# EAGLE schematic Atari_Punk_Console (EAGLE 6.4)
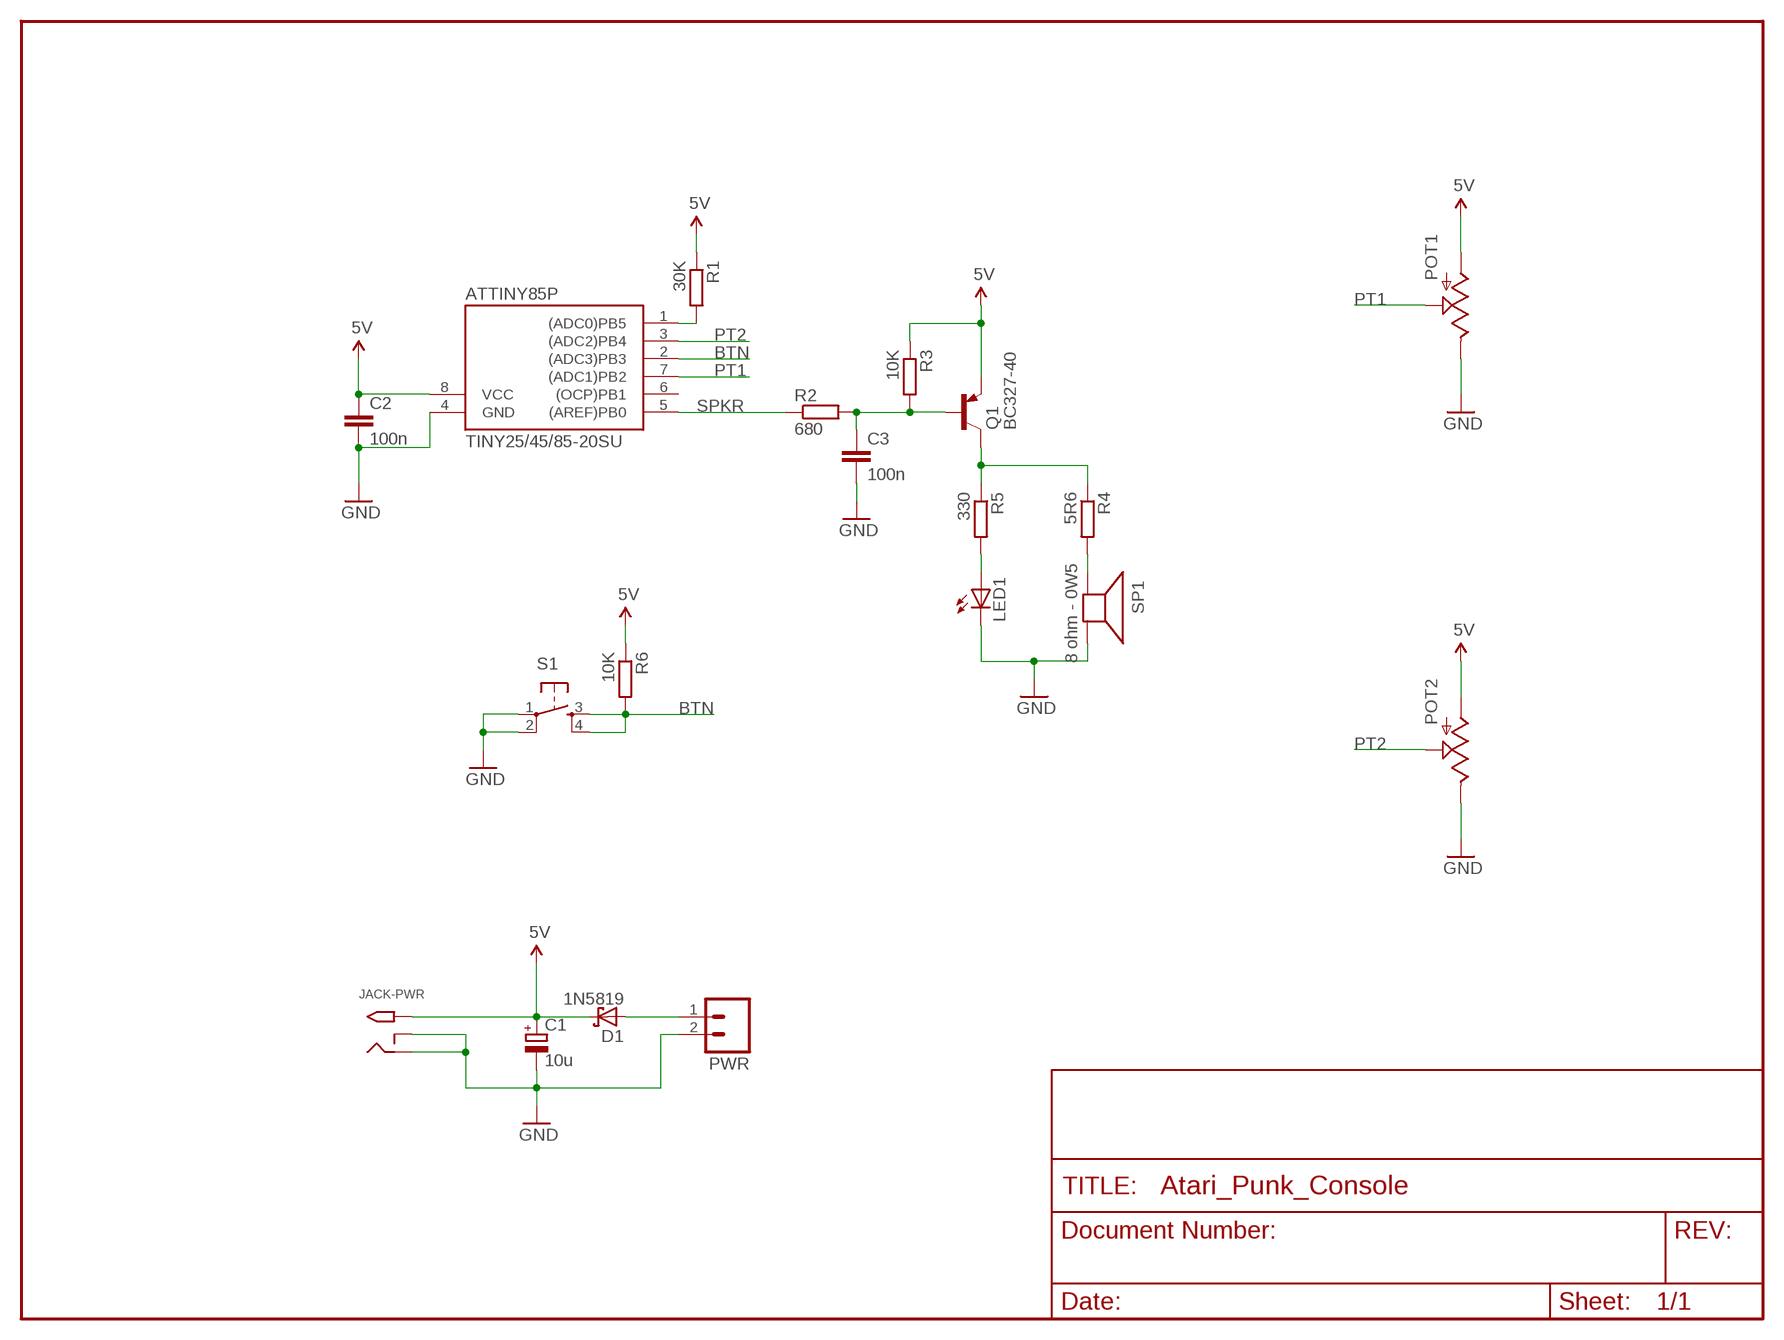
[diagram p0: schematic, sheet 1]

## Parts
ATTINY85P  TINY25/45/85-20SU  [SOIC8]
C1  10u  CPOL-EUE2.5-6  [E2,5-6]
C2  100n  C-EU025-025X050  [C025-025X050]
C3  100n  C-EU025-025X050  [C025-025X050]
D1  1N5819  SCHOTTKY-DIODEDO41-7  [DO41-7]
JACK-PWR  2.1MMJACKTHM  [PJ-102A]
LED1  LED5MM  [LED5MM]
POT1  POT  [ALPS_POT]
POT2  POT  [ALPS_POT]
PWR  M02LOCK  [1X02_LOCK]
Q1  BC327-40  2N2907  [TO92-EBC-OVAL]
R1  30K  R-EU_0207/10  [0207/10]
R2  680  R-EU_0207/10  [0207/10]
R3  10K  R-EU_0207/10  [0207/10]
R4  5R6  R-EU_0207/10  [0207/10]
R5  330  R-EU_0207/10  [0207/10]
R6  10K  R-EU_0207/10  [0207/10]
S1  TAC_SWITCHPTH  [TACTILE-PTH]
SP1  8 ohm - 0W5  SPEAKER/PS12  [PS12]

## Nets
5V: ATTINY85P.8(VCC) C1.+ C2.1 D1.C JACK-PWR.TIP POT1.P$3(A) POT2.P$3(A) Q1.E R1.1 R3.1 R6.1
BTN: ATTINY85P.2((ADC3)PB3) R6.2 S1.3 S1.4
GND: ATTINY85P.4(GND) C1.- C2.2 C3.2 JACK-PWR.RING JACK-PWR.RING_SW LED1.K(C) POT1.P$1(E) POT2.P$1(E) PWR.2 S1.1 S1.2 SP1.P$2(-)
N$1: R4.2 SP1.P$1(+)
N$2: D1.A PWR.1
N$3: Q1.C R4.1 R5.1
N$4: ATTINY85P.1((ADC0)PB5) R1.2
N$5: C3.1 Q1.B R2.2 R3.2
N$8: LED1.A R5.2
PT1: ATTINY85P.7((ADC1)PB2) POT1.P$2(S)
PT2: ATTINY85P.3((ADC2)PB4) POT2.P$2(S)
SPKR: ATTINY85P.5((AREF)PB0) R2.1
Unconnected: ATTINY85P.6((OCP)PB1)

## Library data of the parts
ATTINY85P = avr-7:TINY25/45/85
C1 = resistor:CPOL-EU: POLARIZED CAPACITOR, European symbol
C2 C3 = resistor:C-EU: CAPACITOR, European symbol
D1 = adafruit:SCHOTTKY-DIODE: Schottky Diode
JACK-PWR = adafruit:2.1MMJACK: 2.1mm x 5.5mm THM DC jack with internal switch. Digikey part #PJ-102A, 4UCON part #05537 2.1mm x 5.5mm SMT DC jack with internal switch. Digikey part #PJ-002A-SMT, 4UCON part #03267 By microbuilder.eu & adafruit.com
LED1 = adafruit:LED: LED OSRAM: - CHIPLED LG R971, LG N971, LY N971, LG Q971, LY Q971, LO R971, LY R971 LH N974, LH R974 LS Q976, LO Q976, LY Q976 LO Q996 - Hyper CHIPLED LW Q18S LB Q993, LB Q99A, LB R99A - SideLED LS A670, LO A670, LY A670, LG A670, LP A670 LB A673, LV A673, LT A673, LW A673 LH A674 LY A675 LS A676, LA A676, LO A676, LY A676, LW A676 LS A679, LY A679, LG A679 - Hyper Micro SIDELED® LS Y876, LA Y876, LO Y876, LY Y876 LT Y87S - SmartLED LW L88C, LW L88S LB L89C, LB L89S, LG L890 LS L89K, LO L89K, LY L89K LS L896, LA L896, LO L896, LY L896 - TOPLED LS T670, LO T670, LY T670, LG T670, LP T670 LSG T670, LSP T670, LSY T670, LOP T670, LYG T670 LG T671, LOG T671, LSG T671 LB T673, LV T673, LT T673, LW T673 LH T674 LS T676, LA T676, LO T676, LY T676, LB T676, LH T676, LSB T676, LW T676 LB T67C, LV T67C, LT T67C, LS T67K, LO T67K, LY T67K, LW E67C LS E67B, LA E67B, LO E67B, LY E67B, LB E67C, LV E67C, LT E67C LW T67C LS T679, LY T679, LG T679 LS T770, LO T770, LY T770, LG T770, LP T770 LB T773, LV T773, LT T773, LW T773 LH T774 LS E675, LA E675, LY E675, LS T675 LS T776, LA T776, LO T776, LY T776, LB T776 LHGB T686 LT T68C, LB T68C - Hyper Mini TOPLED® LB M676 - Mini TOPLED Santana® LG M470 LS M47K, LO M47K, LY M47K Source: http://www.osram.convergy.de/
POT1 POT2 = SparkFun:POT
PWR = SparkFun:M02: Header 2 Standard 2-pin 0.1" header. Use with straight break away headers (SKU : PRT-00116), right angle break away headers (PRT-00553), swiss pins (PRT-00743), machine pins (PRT-00117), and female headers (PRT-00115). Molex polarized connector foot print use with SKU : PRT-08233 with associated crimp pins and housings.
Q1 = adafruit:2N2907*: PNP Transistor Big Oval pads
R1-R6 = resistor:R-EU_: RESISTOR, European symbol
S1 = SparkFun:TAC_SWITCH: Momentary Switch Button commonly used for reset or general input. Spark Fun Electronics SKU : COM-00097
SP1 = adafruit:SPEAKER: SPEAKER Source: Buerklin Added PS12 (for part # PS1240 piezo) http://www.ladyada.net/library/pcb/eaglelibrary.html